# EasyEDA Pro project New Project_2025-06-03_19-35-41.eprj

# Schematic Schematic1
Create Date: 2025-06-03; Page Name: P1; Project Name: New Project_2025-06-03_19-35-41; Schematic Name: Schematic1; Update Date: 2025-06-03; Company: 嘉立创EDA; Page Size: A4; Version: V1.0
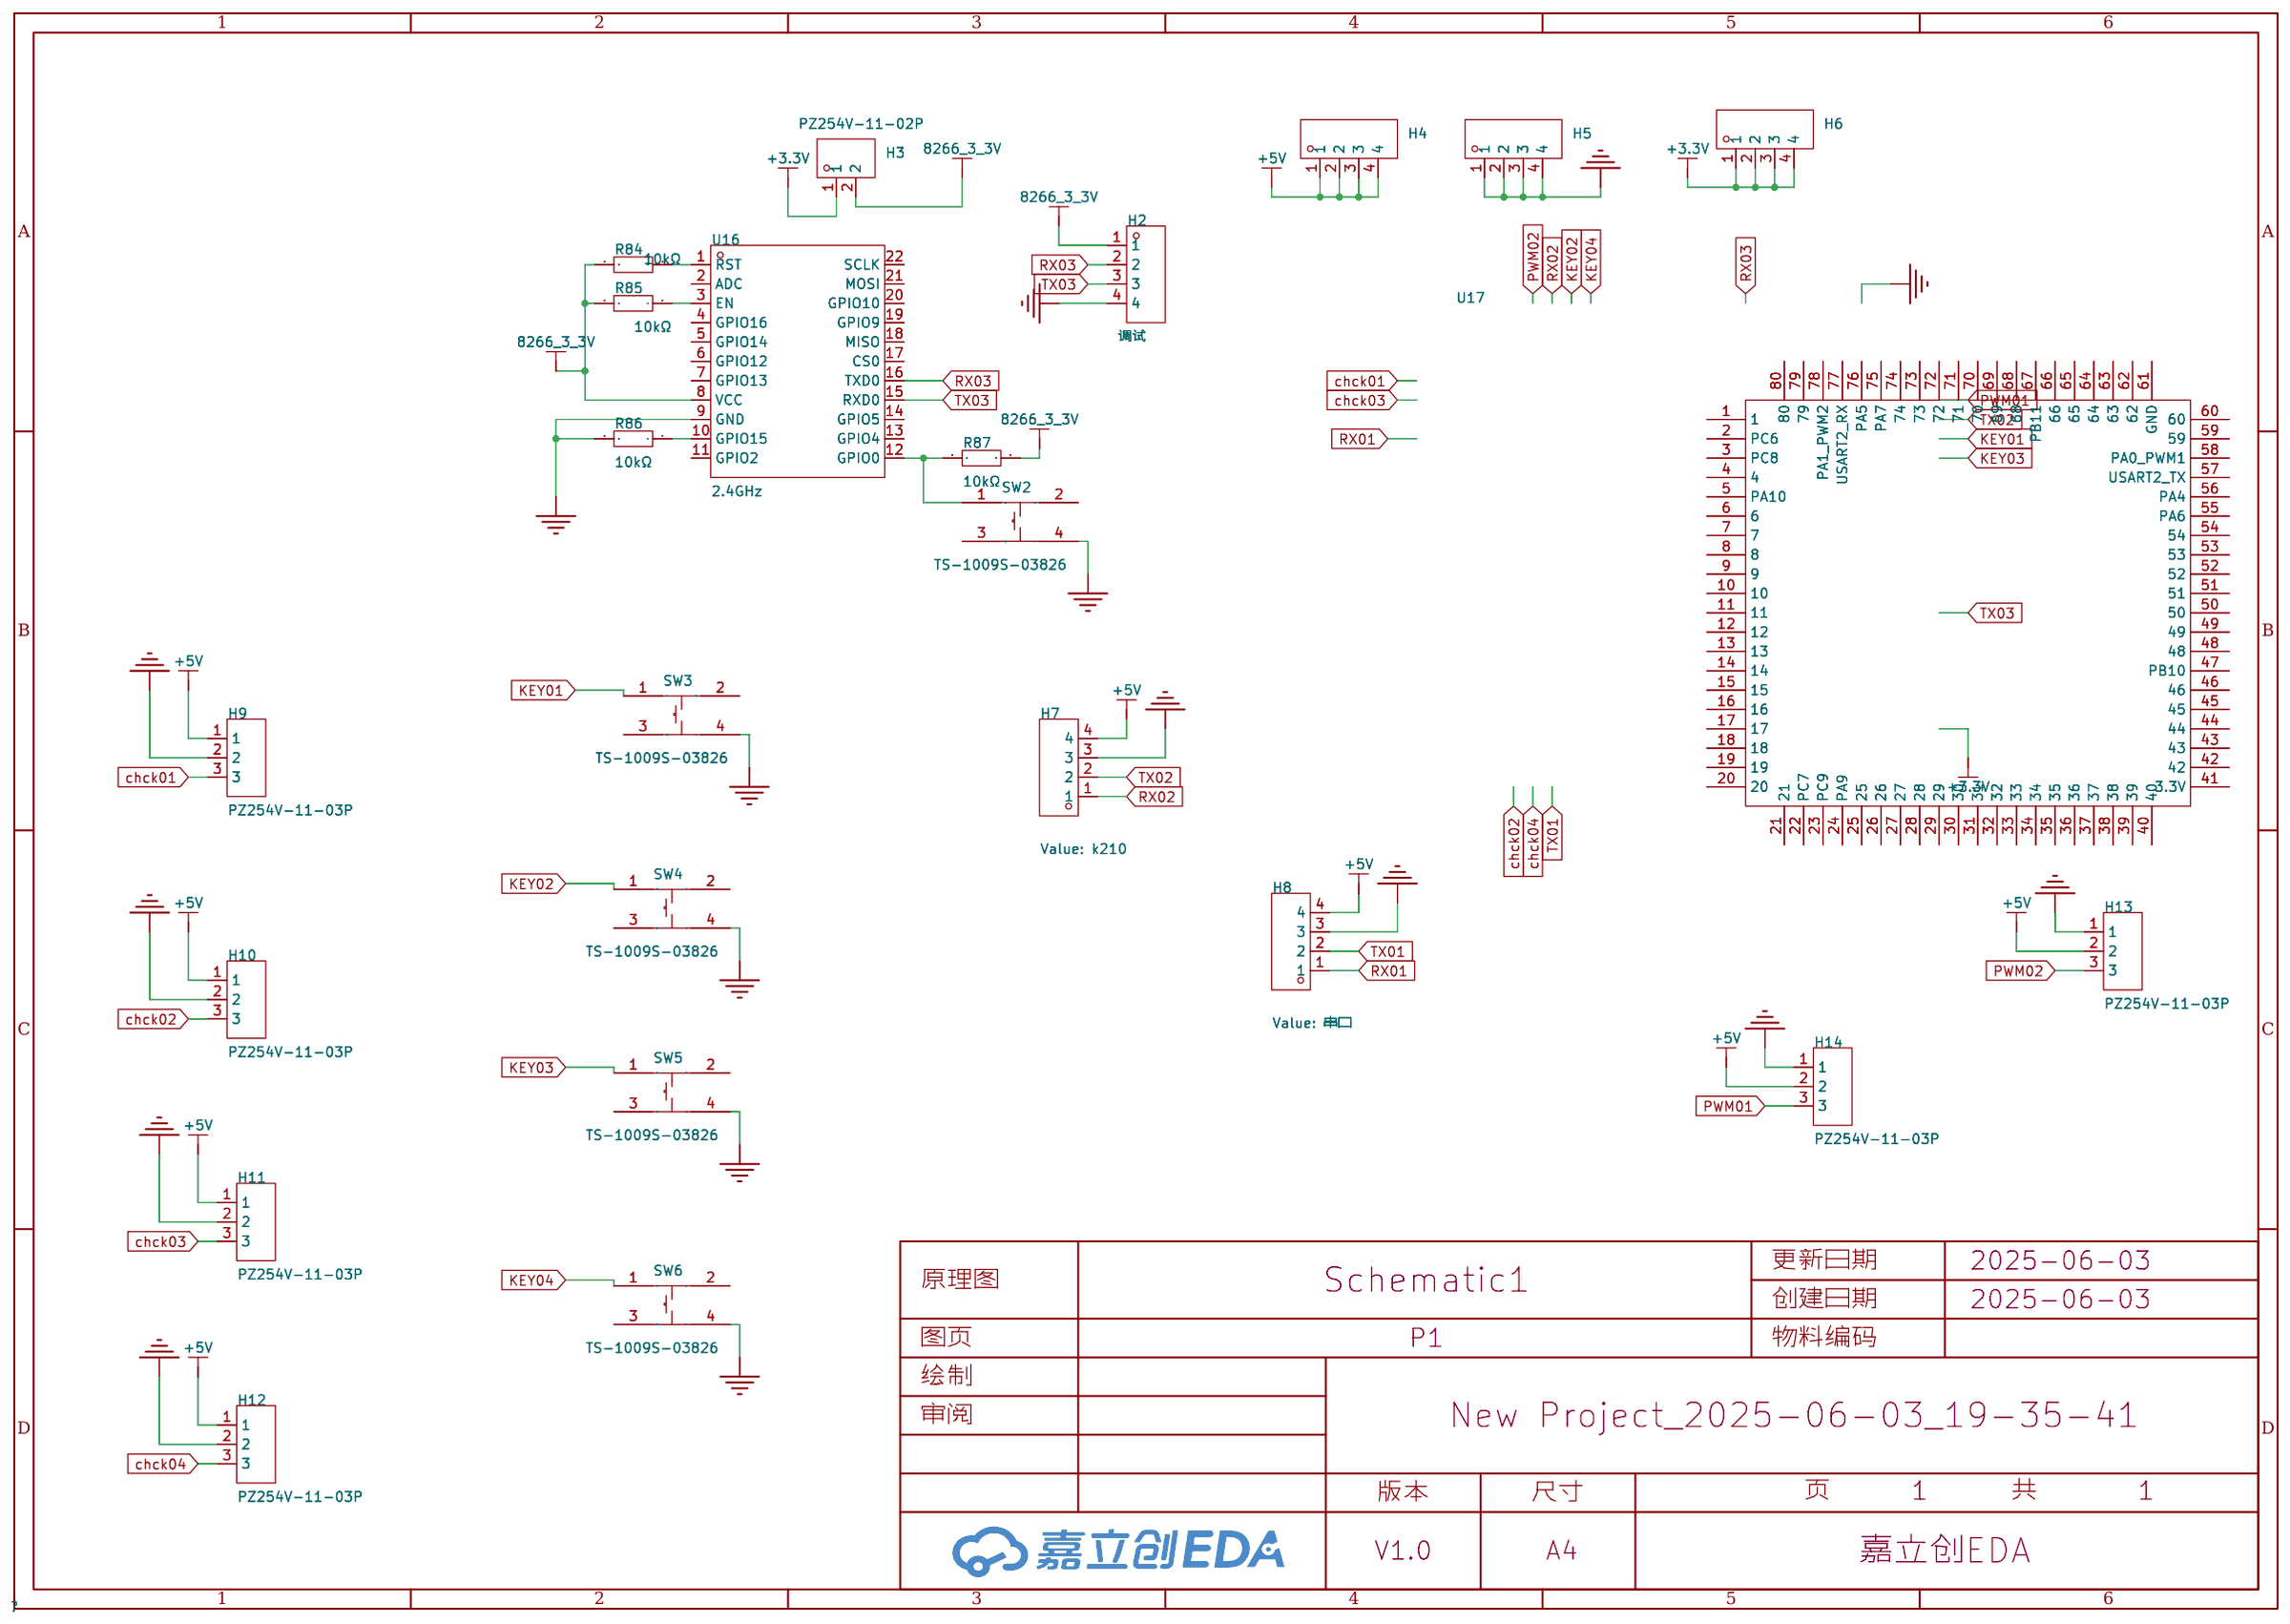
[diagram p0: schematic sheet]

## Parts
H2  调试  [HDR-TH_4P-P2.54-V-M]
H3  PZ254V-11-02P  [HDR-TH_2P-P2.54-V-M]
H4  PZ254V-11-04P  [HDR-TH_4P-P2.54-V-M]
H5  PZ254V-11-04P  [HDR-TH_4P-P2.54-V-M]
H6  PZ254V-11-04P  [HDR-TH_4P-P2.54-V-M]
H7  k210  [HDR-TH_4P-P2.54-V-M]
H8  串口  [HDR-TH_4P-P2.54-V-M]
H9  PZ254V-11-03P  [HDR-TH_3P-P2.54-V-M]
H10  PZ254V-11-03P  [HDR-TH_3P-P2.54-V-M]
H11  PZ254V-11-03P  [HDR-TH_3P-P2.54-V-M]
H12  PZ254V-11-03P  [HDR-TH_3P-P2.54-V-M]
H13  PZ254V-11-03P  [HDR-TH_3P-P2.54-V-M]
H14  PZ254V-11-03P  [HDR-TH_3P-P2.54-V-M]
R84  10kΩ  [c0603]
R85  10kΩ  [c0603]
R86  10kΩ  [c0603]
R87  10kΩ  [c0603]
SW2  TS-1009S-03826  [SW-SMD_4P-L4.5-W4.5-P3.00-LS7.0]
SW3  TS-1009S-03826  [SW-SMD_4P-L4.5-W4.5-P3.00-LS7.0]
SW4  TS-1009S-03826  [SW-SMD_4P-L4.5-W4.5-P3.00-LS7.0]
SW5  TS-1009S-03826  [SW-SMD_4P-L4.5-W4.5-P3.00-LS7.0]
SW6  TS-1009S-03826  [SW-SMD_4P-L4.5-W4.5-P3.00-LS7.0]
U16  2.4GHz  [WIFIM-SMD_ESP-12F-ESP8266MOD]
U17  -  [stmf407vgt6private]

## Library data of the parts
H2 H4-H8 = PZ254V-11-04P: 插针结构:1x4P;间距:2.54mm;行距:-;圆针/方针:方针;安装类型:直插;排数:单排;总PIN位数:4P;额定电流:3A;额定电压:250V;配合针长度:6mm;塑高:2.5mm;端接针长度:3mm;触头材质:-;工作温度范围:-40℃~+105℃;颜色:黑色;; LCSC Part Name: 间距:2.54mm 1x4P 直插 方针; Supplier Part: C2691448; Manufacturer: XFCN(兴飞); Supplier Footprint: 插件,P=2.54mm; JLCPCB Part Class: 扩展库; Datasheet: https://atta.szlcsc.com/upload/public/pdf/source/20200309/C492403_F9F19131791D08044AD4F84F8E751A34.pdf; Supplier: LCSC; Pin Structure: 1x4P; Pitch: 2.54mm; Circluar Pins/Square Pins: 方针; Mounting Type: 直插; Number of Rows: 单排; Number of Pins: 4P; Current Rating (Max): 3A; Voltage Rating (Max): 250V; Length of Mating Pin: 6mm; Insulation Height: 2.5mm; Length of End Connection Pin: 3mm; Operating Temperature Range: -40℃~+105℃; Color: 黑色
H3 = PZ254V-11-02P: 插针结构:1x2P;间距:2.54mm;行距:-;圆针/方针:方针;安装类型:直插;排数:单排;总PIN位数:2P;额定电流:-;额定电压:-;配合针长度:6mm;塑高:2.5mm;端接针长度:3mm;触头材质:黄铜;触头镀层:-;工作温度范围:-40℃~+105℃;颜色:黑色;; LCSC Part Name: 间距:2.54mm 1x2P 直插 方针; Supplier Part: C492401; Manufacturer: XFCN(兴飞); Supplier Footprint: 插件,P=2.54mm; JLCPCB Part Class: 扩展库; Datasheet: https://atta.szlcsc.com/upload/public/pdf/source/20200309/C492401_A812433581A9B211A7FFA413ADDFF0E5.pdf; Supplier: LCSC; Pin Structure: 1x2P; Pitch: 2.54mm; Circluar Pins/Square Pins: 方针; Mounting Type: 直插; Number of Rows: 单排; Number of Pins: 2P; Length of Mating Pin: 6mm; Insulation Height: 2.5mm; Length of End Connection Pin: 3mm; Contact Material: 黄铜; Operating Temperature Range: -40℃~+105℃; Color: 黑色
H9-H14 = PZ254V-11-03P: 插针结构:1x3P;间距:2.54mm;行距:-;圆针/方针:方针;安装方式:直插;排数:单排;总PIN位数:3P;额定电流:3A;额定电压:250V;配合针长度:6mm;塑高:2.5mm;端接针长度:3mm;工作温度:-40℃~+105℃;颜色:黑色;; LCSC Part Name: 1x3P 间距:2.54mm 方针 直插; Supplier Part: C2937625; Manufacturer: XFCN(兴飞); Supplier Footprint: 插件,P=2.54mm; JLCPCB Part Class: 扩展库; Datasheet: https://atta.szlcsc.com/upload/public/pdf/source/20200309/C492402_8335C3D49C4E4C618838D59BB1D024C1.pdf; Supplier: LCSC; Pin Structure: 1x3P; Pitch: 2.54mm; Circluar Pins/Square Pins: 方针; Mounting Type: 直插; Number of Rows: 单排; Number of Pins: 3P; Current Rating: 3A; Voltage Rating (Max): 250V; Length of Mating Pin: 6mm; Insulation Height: 2.5mm; Length of End Connection Pin: 3mm; Operating Temperature: -40℃~+105℃; Color: 黑色
R84-R87 = 1kΩ: Supplier: LCSC; Manufacturer: UniOhm; Manufacturer Part: 0603WAF1001T5E; Supplier Part: C21190; Resistance: 1K; JLCPCB Part Class: Basic Part
SW2-SW6 = TS-1009S-03826: 电路结构:单刀单掷;按钮形状:圆形按钮;安装方式:立贴;开关长度:4.5mm;开关宽度:4.5mm;开关高度:3.8mm;触点电流:50mA;额定电压(DC):12V;带灯:-;机械寿命:-;; LCSC Part Name: 4.5*4.5*3.8mm 立贴 轻触开关; Supplier Part: C455243; Manufacturer: XUNPU(讯普); Supplier Footprint: SMD,4.5x4.5mm; JLCPCB Part Class: 扩展库; Datasheet: https://atta.szlcsc.com/upload/public/pdf/source/20191118/C455248_D35D7E271EC7BD44939E7F982BCB1632.pdf; Supplier: LCSC; Circuit: 单刀单掷; Actuator Style: 圆形按钮; Mounting Style: 立贴; Switch Length: 4.5mm; Switch Width: 4.5mm; Switch Height: 3.8mm; Contact Current: 50mA; Voltage Rating (DC): 12V
U16 = ESP-12F(ESP8266MOD): 核心处理器:ESP8266芯片;频率:2.4GHz;天线形式:板载PCB天线;发射功率:16dBm;接收灵敏度:-90dBm;; LCSC Part Name: 完整的802.11b/g/nWi-FiSoC模块; Supplier Part: C82891; Manufacturer: Ai-Thinker(安信可); Supplier Footprint: SMD,16x24mm; JLCPCB Part Class: 扩展库; Datasheet: https://atta.szlcsc.com/upload/public/pdf/source/20210219/C82891_ABD84A460F4F056A2757267CCCA4B508.pdf; Supplier: LCSC; Core Processor: ESP8266芯片; Support Interface: GPIO；UART；I2C；PWM；SPI；ADC; Antenna Type: 板载PCB天线; Output Power: 16dBm; Operating Voltage: 3.3V; Receive  Current: 120mA; Send  Current: 170mA; Sensitivity: -90dBm; Operating Temperature: -40℃~+85℃
U17 = stm32f407vgt6private

## Nets
+3.3V: H3.1 H6.1 H6.2 H6.3 H6.4
+5V: H4.1 H4.2 H4.3 H4.4 H7.4 H8.4 H9.1 H10.1 H11.1 H12.1 H13.2 H14.2
GND: H2.4 H5.1 H5.2 H5.3 H5.4 H7.3 H8.3 H9.2 H10.2 H11.2 H12.2 H13.1 H14.1 R86.2 SW2.4 SW3.4 SW4.4 SW5.4 SW6.4 U16.9(GND)
8266_3_3V: H2.1 H3.2 R84.2 R85.2 R87.1 U16.8(VCC)
chck01: H9.3
chck02: H10.3
chck03: H11.3
chck04: H12.3
KEY01: SW3.1
KEY02: SW4.1
KEY03: SW5.1
KEY04: SW6.1
PWM01: H14.3
PWM02: H13.3
RX01: H8.1
RX02: H7.1
RX03: H2.2 U16.16(TXD0)
TX01: H8.2
TX02: H7.2
TX03: H2.3 U16.15(RXD0)
$1N496: R84.1 U16.1(RST)
$1N497: R85.1 U16.3(EN)
$1N498: R86.1 U16.10(GPIO15)
$1N500: R87.2 SW2.1 U16.12(GPIO0)

Not connected (* = marked no-connect by the designer): SW2 2 3; SW3 2 3; SW4 2 3; SW5 2 3; SW6 2 3; U16 2(ADC) 4(GPIO16) 5(GPIO14) 6(GPIO12) 7(GPIO13) 11(GPIO2) 13(GPIO4) 14(GPIO5) 17(CS0) 18(MISO) 19(GPIO9) 20(GPIO10) 21(MOSI) 22(SCLK); U17 1 2(PC6) 3(PC8) 4 5(PA10) 6 7 8 9 10 11 12 13 14 15 16 17 18 19 20 21 22(PC7) 23(PC9) 24(PA9) 25 26 27 28 29 30 31 32 33 34 35 36 37 38 39 40 41(3.3V) 42 43 44 45 46 47(PB10) 48 49 50 51 52 53 54 55(PA6) 56(PA4) 57(USART2_TX) 58(PA0_PWM1) 59 60 61(GND) 62 63 64 65 66 67(PB11) 68 69 70 71 72 73 74 75(PA7) 76(PA5) 77(USART2_RX) 78(PA1_PWM2) 79 80

# Board PCB1
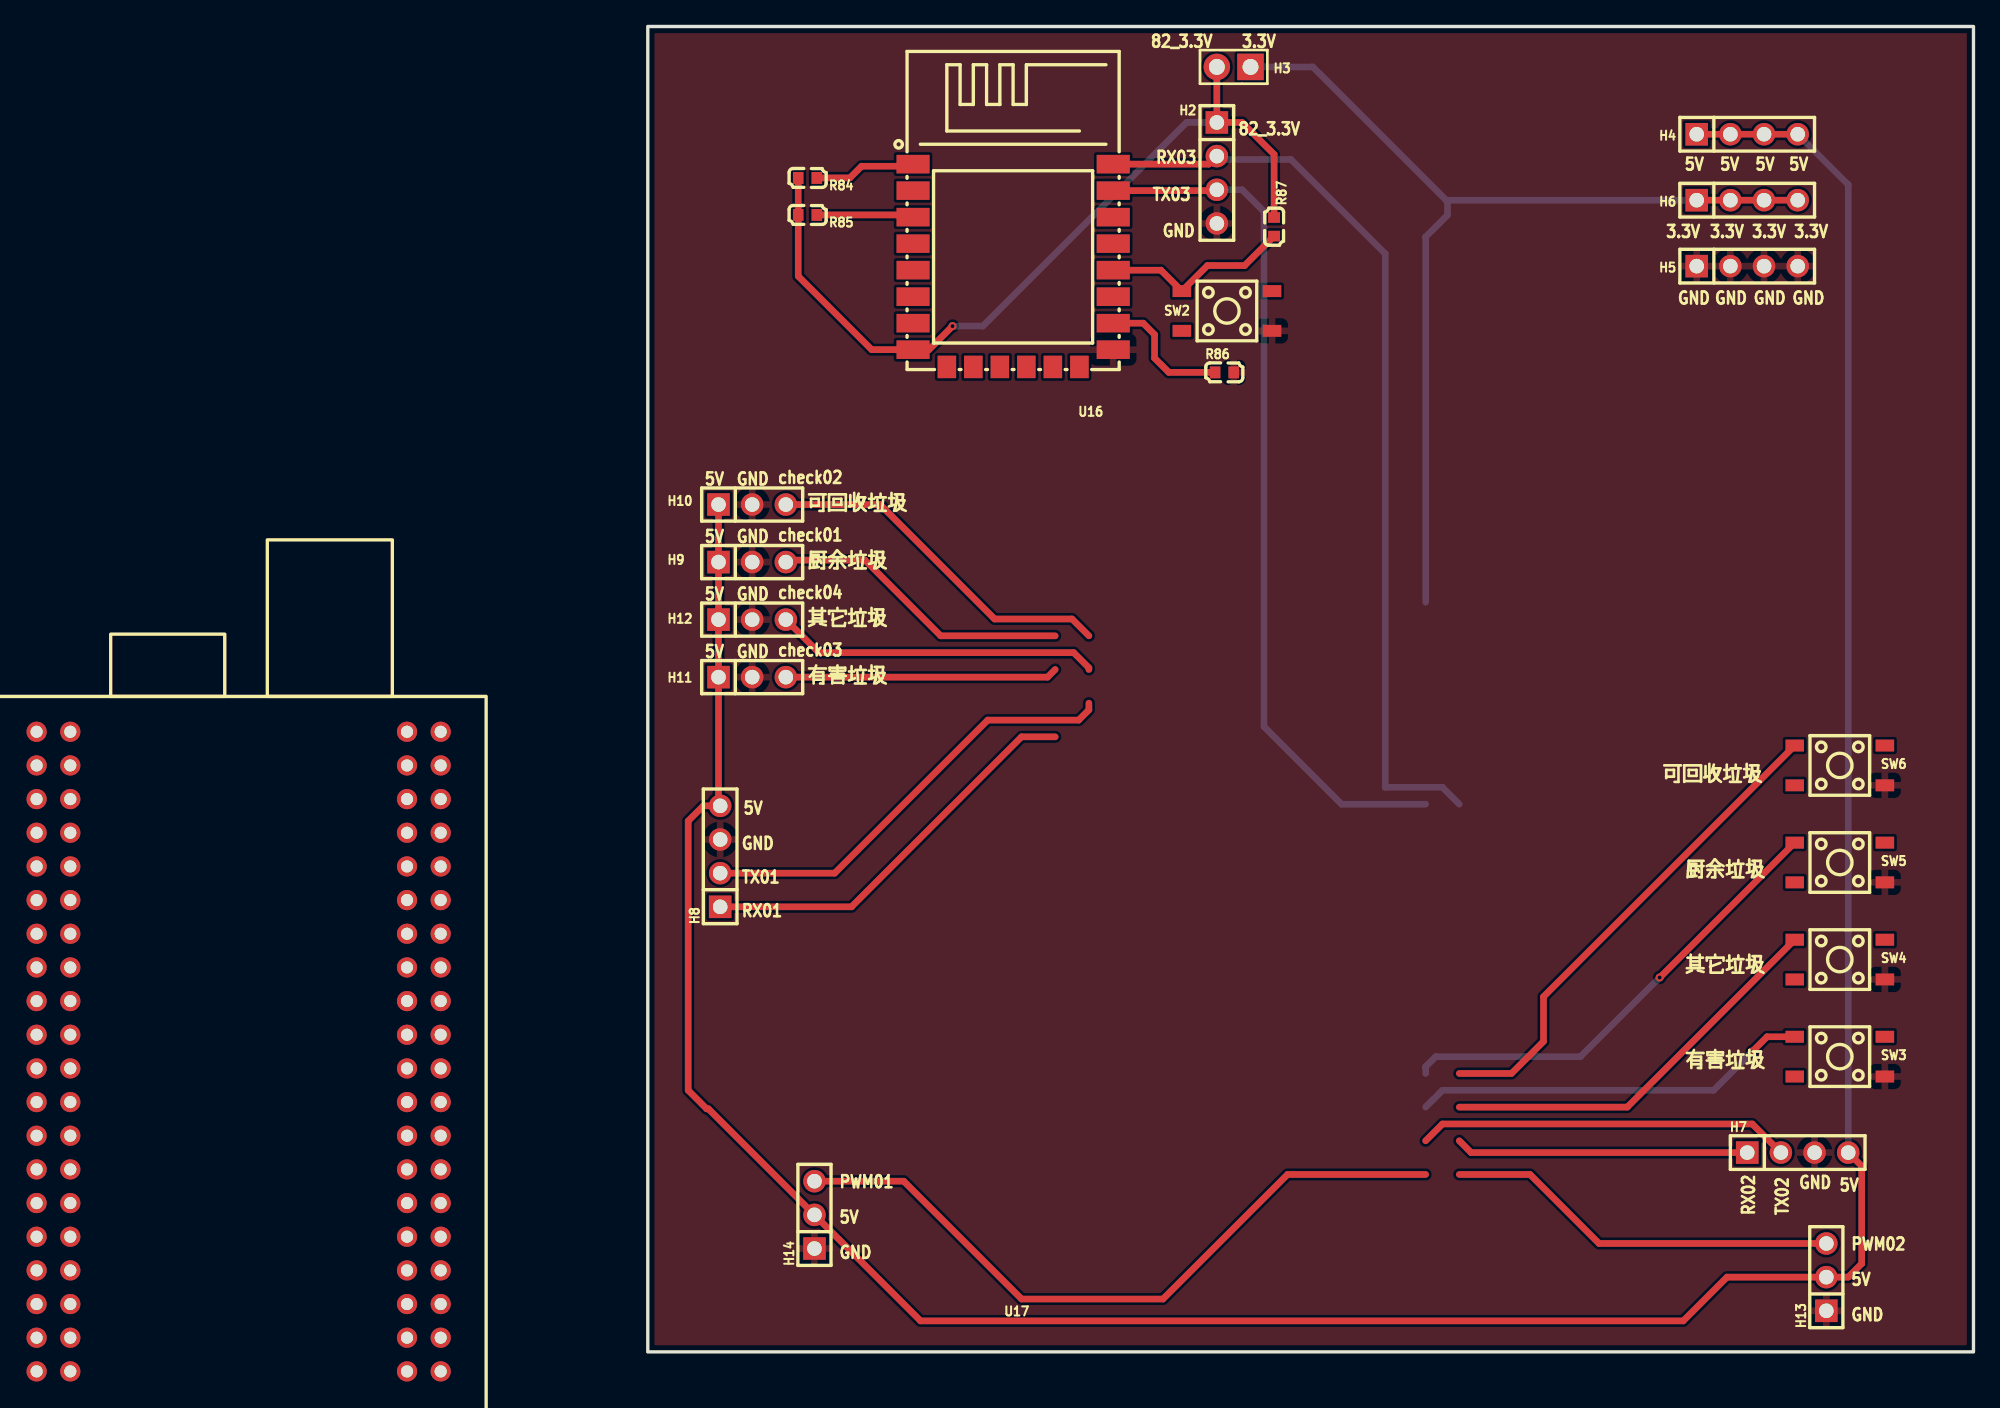
[diagram p1: board, top side]
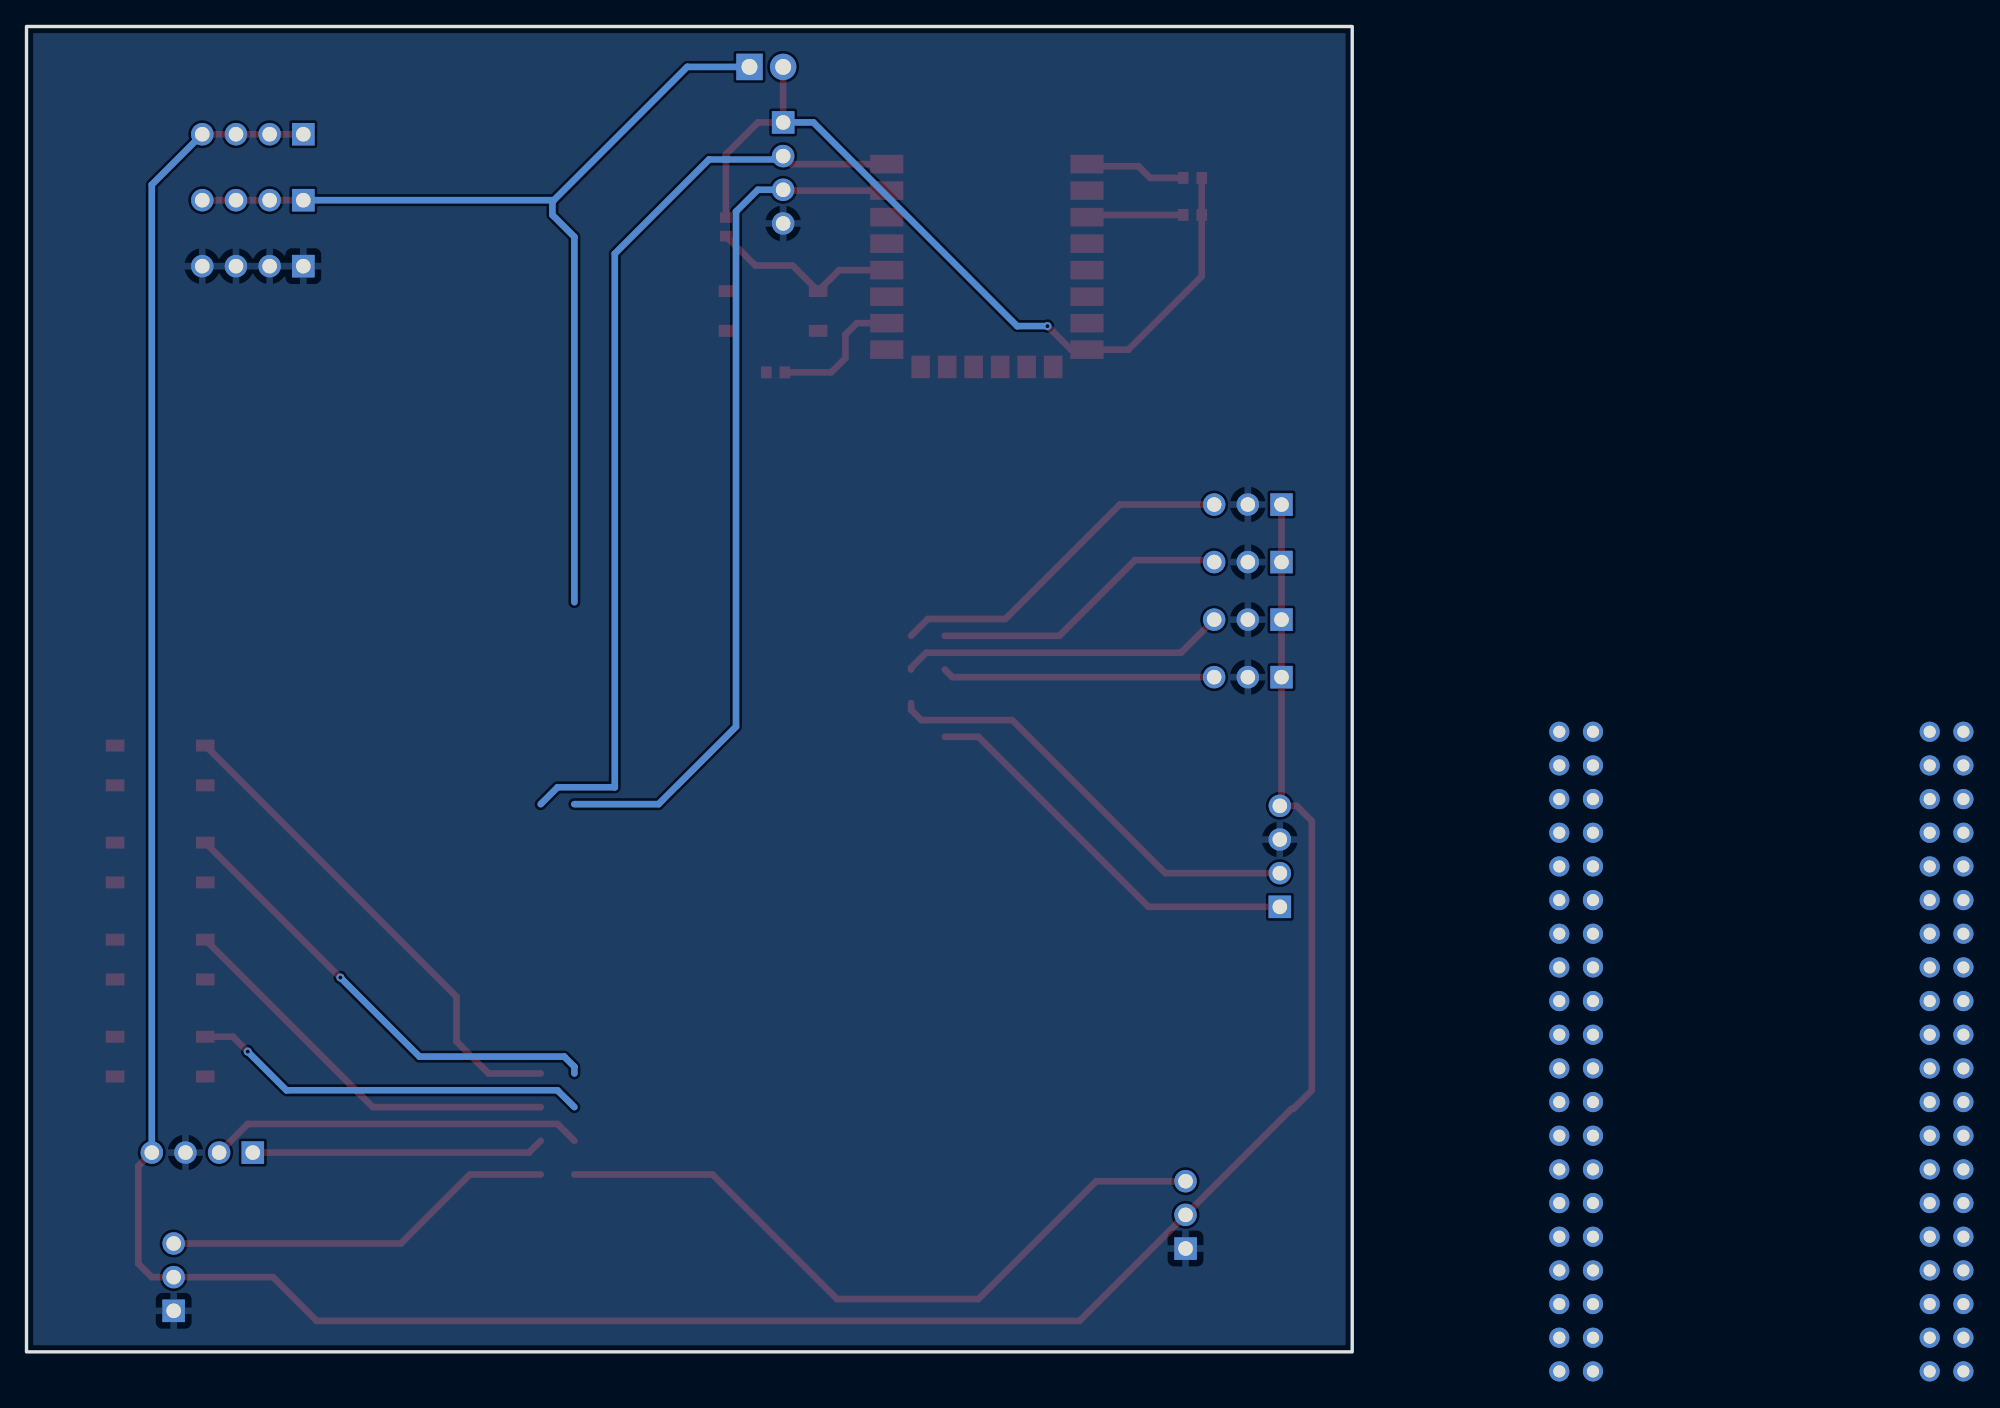
[diagram p2: board, bottom side, seen from below]

Outline 100 x 100 mm; copper layers: Top Layer, Bottom Layer. Coordinates in mm from the lower left corner of the outline.
Outline path: rectangle 0,100 100,0
Stack: Top Layer 0.035mm / Dielectric1 1.51mm FR4 er 4.5 / Bottom Layer 0.035mm

## Design rules (mm)
template: 自定义配置
spacing copperThickness1oz (default): track to track 0.102, other pairs 0.152 to 0.3
spacing copperThickness2oz: track to track 0.203, other pairs 0.152 to 0.3
track width copperThickness1oz (default): min 0.127, default 0.254, max 2.54
track width copperThickness2oz: min 0.203, default 0.254, max 2.54
differential pair differentialPair (default): width min 0.127, default 0.254, max 2.54; gap min 0.152, default 0.152
via viaSize (default): diameter min 0.5, default 0.61, max 10; hole min 0.3, default 0.305, max 6.3

## Placement (name value [footprint] x y rotation side)
H2  调试  [HDR-TH_4P-P2.54-V-M]  42.93 88.95 270 top
H3  PZ254V-11-02P  [HDR-TH_2P-P2.54-V-M]  44.2 96.95 180 top
H4  PZ254V-11-04P  [HDR-TH_4P-P2.54-V-M]  82.93 91.87 0 top
H5  PZ254V-11-04P  [HDR-TH_4P-P2.54-V-M]  82.93 81.92 0 top
H6  PZ254V-11-04P  [HDR-TH_4P-P2.54-V-M]  82.93 86.9 0 top
H7  k210  [HDR-TH_4P-P2.54-V-M]  86.74 15.04 0 top
H8  串口  [HDR-TH_4P-P2.54-V-M]  5.46 37.39 90 top
H9  PZ254V-11-03P  [HDR-TH_3P-P2.54-V-M]  7.87 59.59 0 top
H10  PZ254V-11-03P  [HDR-TH_3P-P2.54-V-M]  7.87 63.93 0 top
H11  PZ254V-11-03P  [HDR-TH_3P-P2.54-V-M]  7.87 50.91 0 top
H12  PZ254V-11-03P  [HDR-TH_3P-P2.54-V-M]  7.87 55.25 0 top
H13  PZ254V-11-03P  [HDR-TH_3P-P2.54-V-M]  88.9 5.64 90 top
H14  PZ254V-11-03P  [HDR-TH_3P-P2.54-V-M]  12.57 10.34 90 top
R84  10kΩ  [c0603]  12.05 88.58 180 top
R85  10kΩ  [c0603]  12.05 85.78 180 top
R86  10kΩ  [c0603]  43.5 73.9 0 top
R87  10kΩ  [c0603]  47.24 84.89 270 top
SW2  TS-1009S-03826  [SW-SMD_4P-L4.5-W4.5-P3.00-LS7.0]  43.69 78.54 0 top
SW3  TS-1009S-03826  [SW-SMD_4P-L4.5-W4.5-P3.00-LS7.0]  89.92 22.28 0 top
SW4  TS-1009S-03826  [SW-SMD_4P-L4.5-W4.5-P3.00-LS7.0]  89.92 29.6 0 top
SW5  TS-1009S-03826  [SW-SMD_4P-L4.5-W4.5-P3.00-LS7.0]  89.92 36.92 0 top
SW6  TS-1009S-03826  [SW-SMD_4P-L4.5-W4.5-P3.00-LS7.0]  89.92 44.25 0 top
U16  2.4GHz  [WIFIM-SMD_ESP-12F-ESP8266MOD]  27.56 81.97 270 top
U17  -  [stmf407vgt6private]  33.27 56.57 0 top

## Footprints (pads in the part's own frame, mm; a bottom-side part is the same pattern mirrored in y, then rotated)
c0603
  rect 0.8x0.9 smd: 1(-0.7,0) 2(0.7,0)
HDR-TH_2P-P2.54-V-M
  rect 2x2 hole 1.2: 1(-1.27,0)
  round 2 hole 1.2: 2(1.27,0)
HDR-TH_3P-P2.54-V-M
  rect 1.7x1.7 hole 1.1: 1(-2.54,0)
  round 1.7 hole 1.1: 2(0,0) 3(2.54,0)
HDR-TH_4P-P2.54-V-M
  rect 1.7x1.7 hole 1.1: 1(-3.81,0)
  round 1.7 hole 1.1: 2(-1.27,0) 3(1.27,0) 4(3.81,0)
stmf407vgt6private
  round 1.524 hole 0.914: 1(-79.375,-9.779) 2(-79.375,-12.319) 3(-79.375,-14.859) 4(-79.375,-17.399) 5(-79.375,-19.939) 6(-79.375,-22.479) 7(-79.375,-25.019) 8(-79.375,-27.559) 9(-79.375,-30.099) 10(-79.375,-32.639) 11(-79.375,-35.179) 12(-79.375,-37.719) 13(-79.375,-40.259) 14(-79.375,-42.799) 15(-79.375,-45.339) 16(-79.375,-47.879) 17(-79.375,-50.419) 18(-79.375,-52.959) 19(-79.375,-55.499) 20(-79.375,-58.039) 21(-76.835,-9.779) 22(-76.835,-12.319) 23(-76.835,-14.859) 24(-76.835,-17.399) 25(-76.835,-19.939) 26(-76.835,-22.479) 27(-76.835,-25.019) 28(-76.835,-27.559) 29(-76.835,-30.099) 30(-76.835,-32.639) 31(-76.835,-35.179) 32(-76.835,-37.719) 33(-76.835,-40.259) 34(-76.835,-42.799) 35(-76.835,-45.339) 36(-76.835,-47.879) 37(-76.835,-50.419) 38(-76.835,-52.959) 39(-76.835,-55.499) 40(-76.835,-58.039) 41(-51.435,-9.779) 42(-51.435,-12.319) 43(-51.435,-14.859) 44(-51.435,-17.399) 45(-51.435,-19.939) 46(-51.435,-22.479) 47(-51.435,-25.019) 48(-51.435,-27.559) 49(-51.435,-30.099) 50(-51.435,-32.639) 51(-51.435,-35.179) 52(-51.435,-37.719) 53(-51.435,-40.259) 54(-51.435,-42.799) 55(-51.435,-45.339) 56(-51.435,-47.879) 57(-51.435,-50.419) 58(-51.435,-52.959) 59(-51.435,-55.499) 60(-51.435,-58.039) 61(-48.895,-9.779) 62(-48.895,-12.319) 63(-48.895,-14.859) 64(-48.895,-17.399) 65(-48.895,-19.939) 66(-48.895,-22.479) 67(-48.895,-25.019) 68(-48.895,-27.559) 69(-48.895,-30.099) 70(-48.895,-32.639) 71(-48.895,-35.179) 72(-48.895,-37.719) 73(-48.895,-40.259) 74(-48.895,-42.799) 75(-48.895,-45.339) 76(-48.895,-47.879) 77(-48.895,-50.419) 78(-48.895,-52.959) 79(-48.895,-55.499) 80(-48.895,-58.039)
SW-SMD_4P-L4.5-W4.5-P3.00-LS7.0
  rect 1.4x0.9 smd: 1(-3.4,1.5) 2(3.4,1.5) 3(-3.4,-1.5) 4(3.4,-1.5)
WIFIM-SMD_ESP-12F-ESP8266MOD
  rect 1.4x2.5 smd: 1(-7.651,-7.551) 2(-5.651,-7.551) 3(-3.651,-7.551) 4(-1.651,-7.551) 5(0.349,-7.551) 6(2.349,-7.551) 7(4.349,-7.551) 8(6.349,-7.551) 9(6.349,7.548) 10(4.349,7.55) 11(2.349,7.551) 12(0.349,7.551) 13(-1.651,7.55) 14(-3.651,7.551) 15(-5.651,7.551) 16(-7.651,7.551)
  rect 1.7x1.4 smd: 17(7.651,-5) 18(7.649,-3.002) 19(7.649,-1.004) 20(7.649,0.998) 21(7.649,2.997) 22(7.651,4.997)

## Nets
+3.3V: H3.1 H6.1 H6.2 H6.3 H6.4 U17.41
+5V: H4.1 H4.2 H4.3 H4.4 H7.4 H8.4 H9.1 H10.1 H11.1 H12.1 H13.2 H14.2
GND: H2.4 H5.1 H5.2 H5.3 H5.4 H7.3 H8.3 H9.2 H10.2 H11.2 H12.2 H13.1 H14.1 R86.2 SW2.4 SW3.4 SW4.4 SW5.4 SW6.4 U16.9 U17.61
8266_3_3V: H2.1 H3.2 R84.2 R85.2 R87.1 U16.8
CHCK01: H9.3 U17.2
CHCK02: H10.3 U17.22
CHCK03: H11.3 U17.3
CHCK04: H12.3 U17.23
KEY01: SW3.1 U17.56
KEY02: SW4.1 U17.76
KEY03: SW5.1 U17.55
KEY04: SW6.1 U17.75
PWM01: H14.3 U17.58
PWM02: H13.3 U17.78
RX01: H8.1 U17.5
RX02: H7.1 U17.77
RX03: H2.2 U16.16 U17.67
TX01: H8.2 U17.24
TX02: H7.2 U17.57
TX03: H2.3 U16.15 U17.47
$1N496: R84.1 U16.1
$1N497: R85.1 U16.3
$1N498: R86.1 U16.10
$1N500: R87.2 SW2.1 U16.12

Pads without a net: SW2 2 3; SW3 2 3; SW4 2 3; SW5 2 3; SW6 2 3; U16 2 4 5 6 7 11 13 14 17 18 19 20 21 22; U17 1 4 6 7 8 9 10 11 12 13 14 15 16 17 18 19 20 21 25 26 27 28 29 30 31 32 33 34 35 36 37 38 39 40 42 43 44 45 46 48 49 50 51 52 53 54 59 60 62 63 64 65 66 68 69 70 71 72 73 74 79 80

## Via types
v1: diameter 0.61, hole 0.305, Top Layer to Bottom Layer, 3 vias

## Routing (per net, layer and track width the routed paths; a pad name or vN(x,y) marks a point on that pad's centre or on a via; arc(x,y) is an arc through that point)
+3.3V: length 76.2
  Top Layer w0.5: H6.4 H6.2 H6.1
  Bottom Layer w0.5: 60.32,86.67 60.32,85.78 58.67,84.12 58.67,56.57 ; H6.1 60.22,86.9 50.16,96.95 H3.1
+5V: length 238.3
  Top Layer w0.5: H7.4 91.57,14.02 91.57,6.66 90.55,5.64 H13.2 81.41,5.64 78.1,2.34 20.57,2.34 H14.2 4.57,18.34 4.44,18.34 3.05,19.74 3.05,40.06 4.19,41.2 H8.4 5.33,41.33 H11.1 H12.1 H9.1 H10.1 ; H4.1 H4.2 H4.4
  Bottom Layer w0.5: H7.4 90.55,88.06 H4.4
8266_3_3V: length 62.7
  Top Layer w0.5: v1(22.99,77.39) 21.21,75.62 U16.8 16.89,75.62 11.35,81.16 R85.2 R84.2 ; H3.2 H2.1 44.83,92.76 47.24,90.35 R87.1
  Bottom Layer w0.5: H2.1 40.64,92.76 25.27,77.39 v1(22.99,77.39)
CHCK01: length 22.7
  Top Layer w0.5: H9.3 10.56,59.74 16.38,59.74 22.1,54.03 30.73,54.03
CHCK02: length 27
  Top Layer w0.5: H10.3 17.53,63.93 26.16,55.3 32,55.3 33.27,54.03
CHCK03: length 20.6
  Top Layer w0.5: 30.73,51.49 30.16,50.91 H11.3
CHCK04: length 24.5
  Top Layer w0.5: H12.3 12.91,52.76 32.13,52.76 33.27,51.61 33.27,51.49
KEY01: length 30
  Top Layer w0.5: SW3.1 84.43,23.78 v1(83.31,22.66)
  Bottom Layer w0.5: 58.67,18.47 59.94,19.74 80.39,19.74 v1(83.31,22.66)
KEY02: length 30.5
  Top Layer w0.5: 61.21,18.47 73.88,18.47 SW4.1
KEY03: length 35.4
  Top Layer w0.5: v1(76.33,28.25) 76.34,28.25 SW5.1
  Bottom Layer w0.5: v1(76.33,28.25) 70.36,22.28 59.44,22.28 58.67,21.51 58.67,21.01
KEY04: length 37.5
  Top Layer w0.5: SW6.1 67.56,26.79 67.56,23.42 65.15,21.01 61.21,21.01
PWM01: length 53.7
  Top Layer w0.5: 58.67,13.39 48.26,13.39 38.86,3.99 28.19,3.99 19.3,12.88 H14.3
PWM02: length 29.8
  Top Layer w0.5: 61.21,13.39 66.55,13.39 71.75,8.18 H13.3
RX01: length 30.6
  Top Layer w0.5: 30.73,46.41 28.19,46.41 15.37,33.58 H8.1
RX02: length 22.1
  Top Layer w0.5: H7.1 62.1,15.04 61.21,15.93
RX03: length 70.2
  Top Layer w0.5: U16.16 42.32,89.62 H2.2
  Bottom Layer w0.5: 61.21,41.33 59.94,42.6 55.63,42.6 55.63,82.86 48.51,89.97 43.18,89.97 H2.2
TX01: length 33.4
  Top Layer w0.5: 33.27,48.95 33.27,48.44 32.5,47.67 25.65,47.67 14.1,36.12 H8.2
TX02: length 28.2
  Top Layer w0.5: 58.67,15.93 59.94,17.2 83.31,17.2 H7.2
TX03: length 65.6
  Top Layer w0.5: U16.15 42.86,87.62 H2.3
  Bottom Layer w0.5: 58.67,41.33 52.32,41.33 46.48,47.17 46.48,86.03 44.83,87.68 H2.3
$1N496: length 7.7
  Top Layer w0.5: U16.1 19.85,89.46 16.13,89.46 15.25,88.58 R84.1
$1N497: length 7.3
  Top Layer w0.5: U16.3 19.84,85.78 R85.1
$1N498: length 10.3
  Top Layer w0.5: U16.10 37.37,77.62 38.23,76.76 38.23,74.98 39.31,73.9 R86.1
$1N500: length 14.5
  Top Layer w0.5: R87.2 45.02,81.97 42.22,81.97 SW2.1 38.71,81.62 U16.12

## Copper pours and planes (outline as drawn; the poured copper is in the pictures)
GND on Top Layer: -15.75,108.25 111.25,108.25 111.25,-24.46 -15.75,-24.46
GND on Bottom Layer: -7.75,113.97 108.71,113.97 108.71,-14.94 -7.75,-14.94

## Text on the board
Top Silkscreen Layer: 5V | GND | TX01 | RX01 | check02 | check01 | check04 | check03 | PWM01 | 82_3.3V | TX03 | RX03 | 3.3V | PWM02 | RX02 | TX02 | 可回收垃圾 | 厨余垃圾 | 其它垃圾 | 有害垃圾
